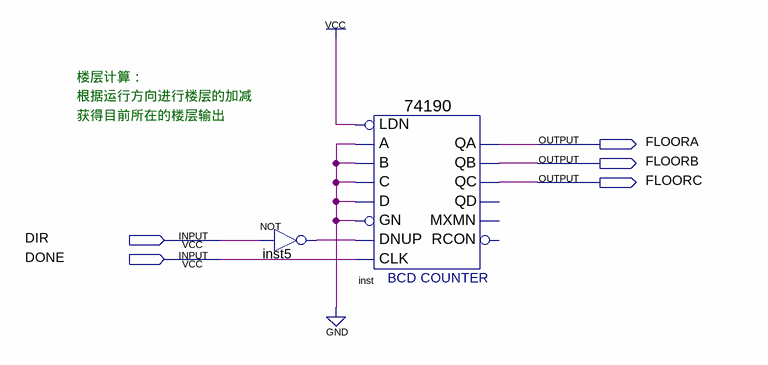
[diagram p0: schematic sheet]
// Quartus schematic floorcount.bdf as structural Verilog: 2 symbols, 5 pins
module floorcount (
  input  DIR,
  input  DONE,
  output FLOORA,
  output FLOORB,
  output FLOORC
);

  wire inst5_out;

  not inst5 (inst5_out, DIR);
  \74190  inst (
    .LDN(1'b1), .A(1'b0), .C(1'b0), .B(1'b0), .D(1'b0), .GN(1'b0), .CLK(DONE), .DNUP(inst5_out), .QA(FLOORA),
    .QB(FLOORB), .QC(FLOORC));  // open: QD, MXMN, RCON

  // Notes on the sheet:
  //   楼层计算：
  //   根据运行方向进行楼层的加减
  //   获得目前所在的楼层输出
endmodule
